# Altium schematic sheet IDE_Terminator.SchDoc: IDE Terminator
size A4; SheetNumber: 1; SheetTotal: 100; Organization: Altium Limited.; Address1: Level 3, 12a Rodborough Rd; Address2: Frenchs Forest 2086; Address3: NSW; Address4: AUSTRALIA
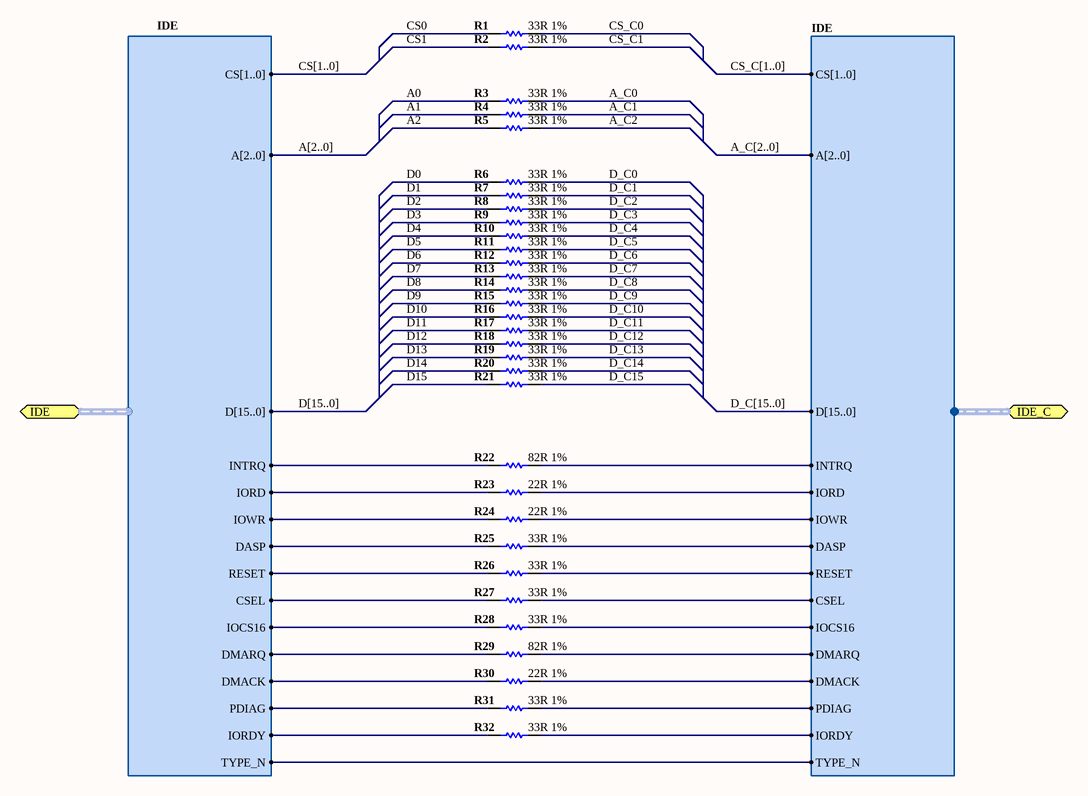
[diagram p0: IDE_Terminator.SchDoc]

## Parts
R1  33R 1%  [RESC1005-STAR]
R2  33R 1%  [RESC1005-STAR]
R3  33R 1%  [RESC1005-STAR]
R4  33R 1%  [RESC1005-STAR]
R5  33R 1%  [RESC1005-STAR]
R6  33R 1%  [RESC1005-STAR]
R7  33R 1%  [RESC1005-STAR]
R8  33R 1%  [RESC1005-STAR]
R9  33R 1%  [RESC1005-STAR]
R10  33R 1%  [RESC1005-STAR]
R11  33R 1%  [RESC1005-STAR]
R12  33R 1%  [RESC1005-STAR]
R13  33R 1%  [RESC1005-STAR]
R14  33R 1%  [RESC1005-STAR]
R15  33R 1%  [RESC1005-STAR]
R16  33R 1%  [RESC1005-STAR]
R17  33R 1%  [RESC1005-STAR]
R18  33R 1%  [RESC1005-STAR]
R19  33R 1%  [RESC1005-STAR]
R20  33R 1%  [RESC1005-STAR]
R21  33R 1%  [RESC1005-STAR]
R22  82R 1%  [RESC1005-STAR]
R23  22R 1%  [RESC1005-STAR]
R24  22R 1%  [RESC1005-STAR]
R25  33R 1%  [RESC1005-STAR]
R26  33R 1%  [RESC1005-STAR]
R27  33R 1%  [RESC1005-STAR]
R28  33R 1%  [RESC1005-STAR]
R29  82R 1%  [RESC1005-STAR]
R30  22R 1%  [RESC1005-STAR]
R31  33R 1%  [RESC1005-STAR]
R32  33R 1%  [RESC1005-STAR]

## Ports
IDE (harness IDE), IDE_C (harness IDE)

## Harnesses
IDE: CS[1..0], A[2..0], D[15..0], INTRQ, IORD, IOWR, DASP, RESET, CSEL, IOCS16, DMARQ, DMACK, PDIAG, IORDY, TYPE_N

## Nets
A0: R3.1
A1: R4.1
A2: R5.1
A_C0: R3.2
A_C1: R4.2
A_C2: R5.2
CS0: R1.1
CS1: R2.1
CS_C0: R1.2
CS_C1: R2.2
D0: R6.1
D1: R7.1
D2: R8.1
D3: R9.1
D4: R10.1
D5: R11.1
D6: R12.1
D7: R13.1
D8: R14.1
D9: R15.1
D10: R16.1
D11: R17.1
D12: R18.1
D13: R19.1
D14: R20.1
D15: R21.1
D_C0: R6.2
D_C1: R7.2
D_C2: R8.2
D_C3: R9.2
D_C4: R10.2
D_C5: R11.2
D_C6: R12.2
D_C7: R13.2
D_C8: R14.2
D_C9: R15.2
D_C10: R16.2
D_C11: R17.2
D_C12: R18.2
D_C13: R19.2
D_C14: R20.2
D_C15: R21.2
NetR22_1: R22.1 ; port IDE.INTRQ
NetR22_2: R22.2 ; port IDE_C.INTRQ
NetR23_1: R23.1 ; port IDE.IORD
NetR23_2: R23.2 ; port IDE_C.IORD
NetR24_1: R24.1 ; port IDE.IOWR
NetR24_2: R24.2 ; port IDE_C.IOWR
NetR25_1: R25.1 ; port IDE.DASP
NetR25_2: R25.2 ; port IDE_C.DASP
NetR26_1: R26.1 ; port IDE.RESET
NetR26_2: R26.2 ; port IDE_C.RESET
NetR27_1: R27.1 ; port IDE.CSEL
NetR27_2: R27.2 ; port IDE_C.CSEL
NetR28_1: R28.1 ; port IDE.IOCS16
NetR28_2: R28.2 ; port IDE_C.IOCS16
NetR29_1: R29.1 ; port IDE.DMARQ
NetR29_2: R29.2 ; port IDE_C.DMARQ
NetR30_1: R30.1 ; port IDE.DMACK
NetR30_2: R30.2 ; port IDE_C.DMACK
NetR31_1: R31.1 ; port IDE.PDIAG
NetR31_2: R31.2 ; port IDE_C.PDIAG
NetR32_1: R32.1 ; port IDE.IORDY
NetR32_2: R32.2 ; port IDE_C.IORDY
(unnamed): port IDE.TYPE_N, port IDE_C.TYPE_N

## Buses and harness runs
bus A[2..0]
bus A_C[2..0]
bus CS[1..0]
bus CS_C[1..0]
bus D[15..0]
bus D_C[15..0]

## Notes on the sheet
- Sheet Title
- Project Title
- Size:
- Date:
- A4
- Assy:
- Time:
- Revision:
- Sheet
- of
- File:

## Library data of the parts
R1-R21 R25-R28 R31 R32 = D-100-0102: Resistor, 33R 1% 0402 (1005); Power Rating: 63 mW; Category: Resistor; Mounting Technology: Surface Mount; Resistance: 33 R; Status: Production; Tolerance: 1 %
R22 R29 = D-100-0076: Resistor, 82R 1% 0402 (1005); Power Rating: 63 mW; Category: Resistor; Mounting Technology: Surface Mount; Resistance: 82 R; Status: Production; Tolerance: 1 %
R23 R24 R30 = D-100-0113: Resistor, 22R 1% 0402 (1005); Power Rating: 63 mW; Category: Resistor; Mounting Technology: Surface Mount; Resistance: 22 R; Status: Production; Tolerance: 1 %